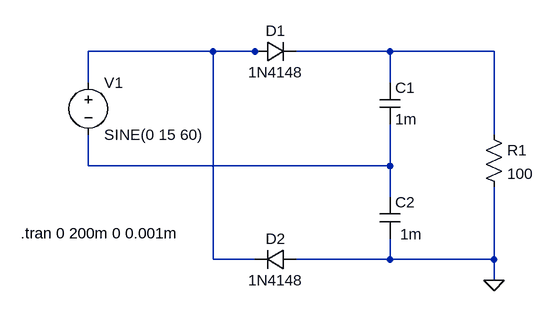
[diagram p0: schematic dobrador_de_tensão.asc]
dobrador_de_tensão.asc, the LTspice schematic file:
Version 4
SHEET 1 884 680
WIRE 304 304 112 304
WIRE 368 304 304 304
WIRE 384 304 368 304
WIRE 576 304 432 304
WIRE 736 304 576 304
WIRE 112 352 112 304
WIRE 576 352 576 304
WIRE 736 432 736 304
WIRE 112 480 112 432
WIRE 576 480 576 416
WIRE 576 480 112 480
WIRE 576 528 576 480
WIRE 304 624 304 304
WIRE 368 624 304 624
WIRE 576 624 576 592
WIRE 576 624 432 624
WIRE 736 624 736 512
WIRE 736 624 576 624
WIRE 736 656 736 624
FLAG 736 656 0
SYMBOL voltage 112 336 R0
WINDOW 123 0 0 Left 0
WINDOW 39 0 0 Left 0
SYMATTR InstName V1
SYMATTR Value SINE(0 15 60)
SYMBOL diode 368 320 R270
WINDOW 0 32 32 VTop 2
WINDOW 3 0 32 VBottom 2
SYMATTR InstName D1
SYMATTR Value 1N4148
SYMBOL res 720 416 R0
SYMATTR InstName R1
SYMATTR Value 100
SYMBOL cap 560 352 R0
SYMATTR InstName C1
SYMATTR Value 1m
SYMBOL diode 432 608 R90
WINDOW 0 0 32 VBottom 2
WINDOW 3 32 32 VTop 2
SYMATTR InstName D2
SYMATTR Value 1N4148
SYMBOL cap 560 528 R0
WINDOW 3 32 57 Left 2
SYMATTR Value 1m
SYMATTR InstName C2
TEXT 8 584 Left 2 !.tran 0 200m 0 0.001m

The netlist it stands for:
* dobrador_de_tensão.asc
V1 N001 N003 SINE(0 15 60)
D1 N001 N002 1N4148
R1 N002 0 100
C1 N002 N003 1m
D2 0 N001 1N4148
C2 N003 0 1m
.model D D
.lib standard.dio
.tran 0 200m 0 0.001m
.backanno
.end